# Altium project DACSN.PrjPcb
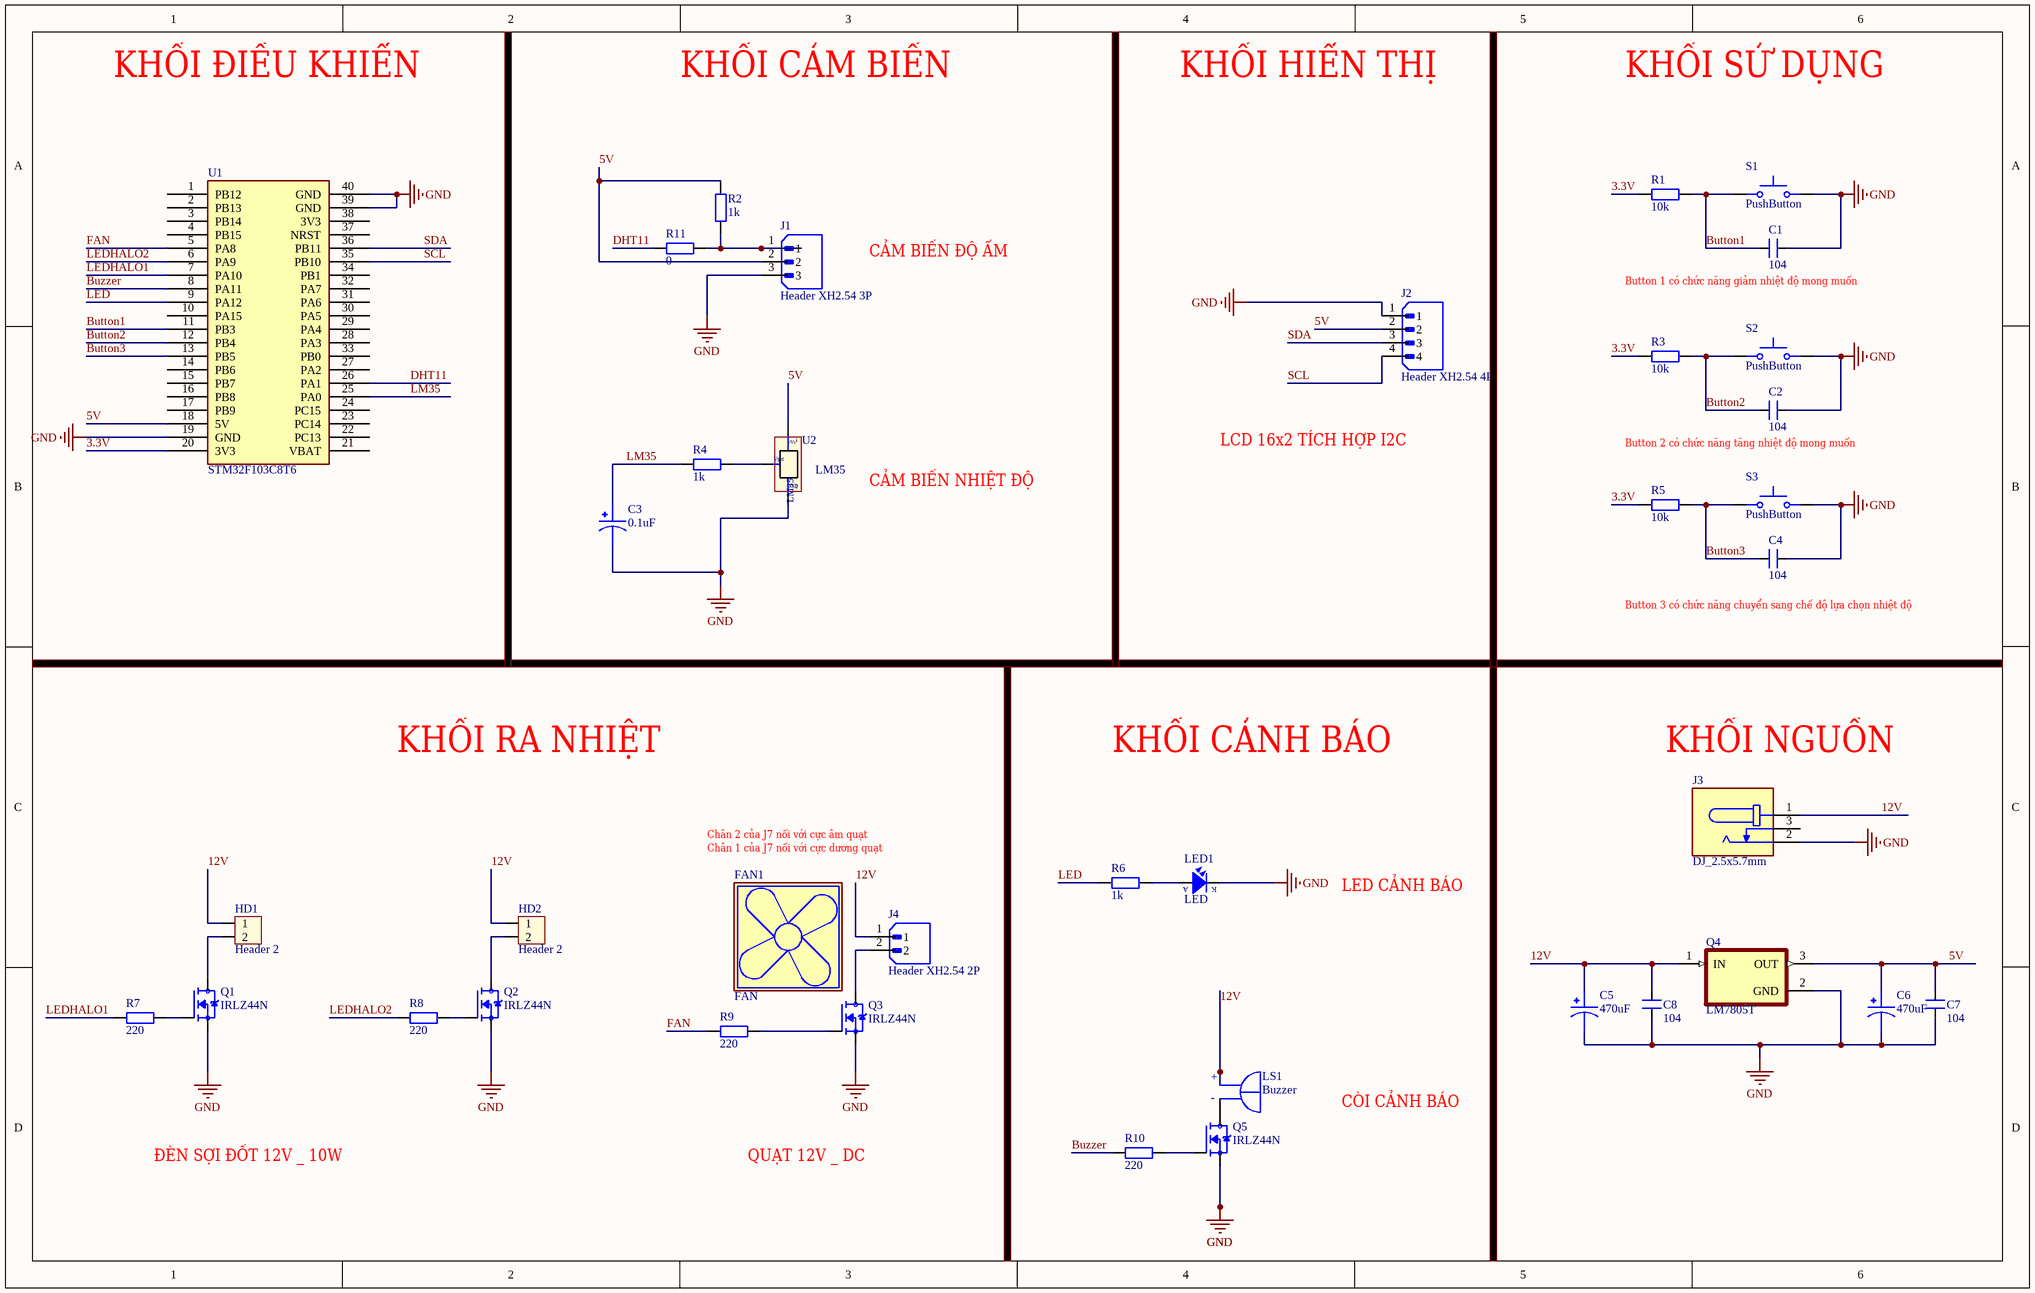
[diagram p0: Schematic_DA.SchDoc]
1 sheet, 38 parts. Net scope: global (net labels, ports and power ports of the same name join across sheets).
Board file: MachPCB.PcbDoc

## Sheet Schematic_DA.SchDoc
size B; SheetNumber: 1; SheetTotal: 1

### Parts
C1  104  [CN1]
C2  104  [CN1]
C3  0.1uF  [CAPPRD200W50D550H1250]
C4  104  [CN1]
C5  470uF  [CAPPRD200W50D550H1250]
C6  470uF  [CAPPRD200W50D550H1250]
C7  104  [CN1]
C8  104  [CN1]
FAN1  FAN  [EE40100S2-1000U-999]
HD1  Header 2  [HED2]
HD2  Header 2  [HED2]
J1  Header XH2.54 3P  [JST_B3B-XH-A]
J2  Header XH2.54 4P  [JST_B4B-XH-A]
J3  DJ_2.5x5.7mm  [CUI_PJ-059B]
J4  Header XH2.54 2P  [JST_B2B-XH-A]
LED1  LED  [LED-5R]
LS1  Buzzer  [Buzzer-5V]
Q1  IRLZ44N  [TO254P1054X469X1930-3]
Q2  IRLZ44N  [TO254P1054X469X1930-3]
Q3  IRLZ44N  [TO254P1054X469X1930-3]
Q4  LM7805T  [TO254P1054X470X2600-3]
Q5  IRLZ44N  [TO254P1054X469X1930-3]
R1  10k  [R1/4W]
R2  1k  [R1/4W]
R3  10k  [R1/4W]
R4  1k  [R1/4W]
R5  10k  [R1/4W]
R6  1k  [R1/4W]
R7  220  [R1/4W]
R8  220  [R1/4W]
R9  220  [R1/4W]
R10  220  [R1/4W]
R11  0  [R1/4W]
S1  PushButton  [SW_800AWSP9M2QE]
S2  PushButton  [SW_800AWSP9M2QE]
S3  PushButton  [SW_800AWSP9M2QE]
U1  STM32F103C8T6  [Stm32 BluePill]
U2  LM35  [QTO-92]

### Nets
GND: C1.2 C2.2 C3.2 C4.2 C5.2 C6.2 C7.1 C8.1 J1.3 J2.1 J3.2 LED1.2(K) Q1.3(S) Q2.3(S) Q3.3(S) Q4.2(GND) Q5.3(S) S1.3 S2.3 S3.3 U1.19(GND) U1.39(GND) U1.40(GND) U2.3(-)
3.3V: R1.1 R3.1 R5.1 U1.20(3V3)
5V: C6.1 C7.2 J1.2 J2.2 Q4.3(OUT) R2.2 U1.18(5V) U2.1(+Vs)
12V: C5.1 C8.2 HD1.1 HD2.1 J3.1 J4.1 LS1.P(POS) Q4.1(IN)
Button1: C1.1 R1.2 S1.1 U1.11(PB3)
Button2: C2.1 R3.2 S2.1 U1.12(PB4)
Button3: C4.1 R5.2 S3.1 U1.13(PB5)
Buzzer: R10.1 U1.8(PA11)
DHT11: R11.1 U1.26(PA1)
FAN: R9.1 U1.5(PA8)
LED: R6.1 U1.9(PA12)
LEDHALO1: R7.1 U1.7(PA10)
LEDHALO2: R8.1 U1.6(PA9)
LM35: C3.1 R4.1 U1.25(PA0)
SCL: J2.4 U1.35(PB10)
SDA: J2.3 U1.36(PB11)
NetHD1_2: HD1.2 Q1.2(D)
NetHD2_2: HD2.2 Q2.2(D)
NetJ1_1: J1.1 R2.1 R11.2
NetJ4_2: J4.2 Q3.2(D)
NetLED1_1: LED1.1(A) R6.2
NetLS1_N: LS1.N(NEG) Q5.2(D)
NetQ1_1: Q1.1(G) R7.2
NetQ2_1: Q2.1(G) R8.2
NetQ3_1: Q3.1(G) R9.2
NetQ5_1: Q5.1(G) R10.2
NetR4_2: R4.2 U2.2(Vout)

Not connected (* = marked no-connect by the designer): J3 3; U1 1(PB12) 2(PB13) 3(PB14) 4(PB15) 10(PA15) 14(PB6) 15(PB7) 16(PB8) 17(PB9) 21(VBAT) 22(PC13) 23(PC14) 24(PC15) 27(PA2) 28(PA3) 29(PA4) 30(PA5) 31(PA6) 32(PA7) 33(PB0) 34(PB1) 37(NRST) 38(3V3)

### Notes on the sheet
- KHỐI ĐIỀU KHIỂN
- KHỐI CẢM BIẾN
- KHỐI HIỂN THỊ
- KHỐI SỬ DỤNG
- CẢM BIẾN ĐỘ ẨM
- (near C1) Button 1 có chức năng giảm nhiệt độ mong muốn
- CẢM BIẾN NHIỆT ĐỘ
- LCD 16x2 TÍCH HỢP I2C
- (near C2) Button 2 có chức năng tăng nhiệt độ mong muốn
- (near C4) Button 3 có chức năng chuyển sang chế độ lựa chọn nhiệt độ
- KHỐI RA NHIỆT
- KHỐI CẢNH BÁO
- KHỐI NGUỒN
- Chân 2 của J7 nối với cực âm quạt
- Chân 1 của J7 nối với cực dương quạt
- LED CẢNH BÁO
- CÒI CẢNH BÁO
- ĐÈN SỢI ĐỐT 12V _ 10W
- QUẠT 12V _ DC
- (in symbol Buzzer) +; -
- (in symbol LM35) GND

### Library data of the parts
C1 C2 C4 C7 C8 = CN1: Cap np  1pF - 472pF; Value: 100pF
C3 C5 C6 = Tu Hoa 4.7uF: Capacitor, Aluminum Electrolytic, Cap 4.7uF 25V 20%, Radial 5X11 LS 5 mm | Nichicon UVR1E4R7MDD; SnapEDA_Link: https://www.snapeda.com/parts/UVR1E4R7MDD/Nichicon/view-part/?ref=snap; Package: RADIAL-2 NICHICON; Value: *; MF: Nichicon; MP: UVR1E4R7MDD; Check_prices: https://www.snapeda.com/parts/UVR1E4R7MDD/Nichicon/view-part/?ref=eda
FAN1 = FAN: Fan,DC,5V,7.1CFM,120A,0.6W,6100RPM,23dBA,SLEEVE,40X40X10mm, | Sunon Fans EE40100S2-1000U-999; SnapEDA_Link: https://www.snapeda.com/parts/EE40100S2-1000U-999/Sunon+Fans/view-part/?ref=snap; Package: None; Value: *; MF: Sunon; MP: EE40100S2-1000U-999; Check_prices: https://www.snapeda.com/parts/EE40100S2-1000U-999/Sunon+Fans/view-part/?ref=eda
HD1 HD2 = Hed2: Header 2 (Green); Value: Header 2
J1 = Header XH2.54 3P: Connector Header Through Hole 3 position 0.098 (2.54mm); MF: JST Sales; MP: B3B-XH-A; SnapEDA_Link: https://www.snapeda.com/parts/B3B-XH-A/JST+Sales+America+Inc./view-part/?ref=snap; Package: None; Value: *; Check_prices: https://www.snapeda.com/parts/B3B-XH-A/JST+Sales+America+Inc./view-part/?ref=eda
J2 = Header XH2.54 4P: Connector Header Through Hole 4 position 0.098 (2.54mm); MF: JST Sales; MP: B4B-XH-A; SnapEDA_Link: https://www.snapeda.com/parts/B4B-XH-A/JST/view-part/?ref=snap; Package: None; Value: *; Check_prices: https://www.snapeda.com/parts/B4B-XH-A/JST/view-part/?ref=eda
J3 = DJ_2.5x5.7mm: MF: {'manufacturer': u'CUI'}; MP: PJ-059B; Package: None; Price: None; Value: *; Availability: Unavailable
J4 = Header XH2.54 2P: Connector Header Through Hole 2 position 0.098 (2.54mm); MF: {'manufacturer': u'JST Sales America Inc.'}; MP: B2B-XH-A; Package: None; Price: None; Value: *; Availability: Unavailable
LED1 = LED: LED Single colour Green and Red; Value: LED 3 ly Single Colour
LS1 = Buzzer: MP: KPEG242-5V; Availability: Unavailable; Price: None; Package: None; Value: *
Q1-Q3 Q5 = IRLZ44N: N-Channel 55 V 47A (Tc) 3.8W (Ta), 110W (Tc) Surface Mount D2PAK; MF: Infineon / IR; Package: TO-220-3 Infineon / IR; Availability: Not in stock; Value: *; MP: IRLZ44N; Check_prices: https://www.snapeda.com/parts/IRLZ44N/Infineon/view-part/?ref=eda; Price: None; SnapEDA_Link: https://www.snapeda.com/parts/IRLZ44N/Infineon/view-part/?ref=snap
Q4 = LM7805T: IC Regulator 7805T/LM7805T COMSET RoHS TO220; MF: Comset Semiconductors; MP: LM7805CT; SnapEDA_Link: https://www.snapeda.com/parts/LM7805CT/Comset+Semiconductors/view-part/?ref=snap; Package: TO-220 Comset Semiconductors; Value: *; Check_prices: https://www.snapeda.com/parts/LM7805CT/Comset+Semiconductors/view-part/?ref=eda
R1-R11 = R1/4W: Resistor 1/4W; Value: R1/4W - 1K
S1-S3 = PushButton: Pushbutton Switch,800A Series,SPST,OFF-(ON),Black,Through Hole,1A,250VAC,PC | E-Switch 800AWSP9M2QE; SnapEDA_Link: https://www.snapeda.com/parts/800AWSP9M2QE/E-Switch/view-part/?ref=snap; Package: None; Value: *; MF: E-Switch; MP: 800AWSP9M2QE; Check_prices: https://www.snapeda.com/parts/800AWSP9M2QE/E-Switch/view-part/?ref=eda
U1 = STM32F103C8T6 BluePill: Designed By @Alixahedi
U2 = LM35: Teminal; Value: LM35